# EAGLE design thermistor (EAGLE 9.4.2)
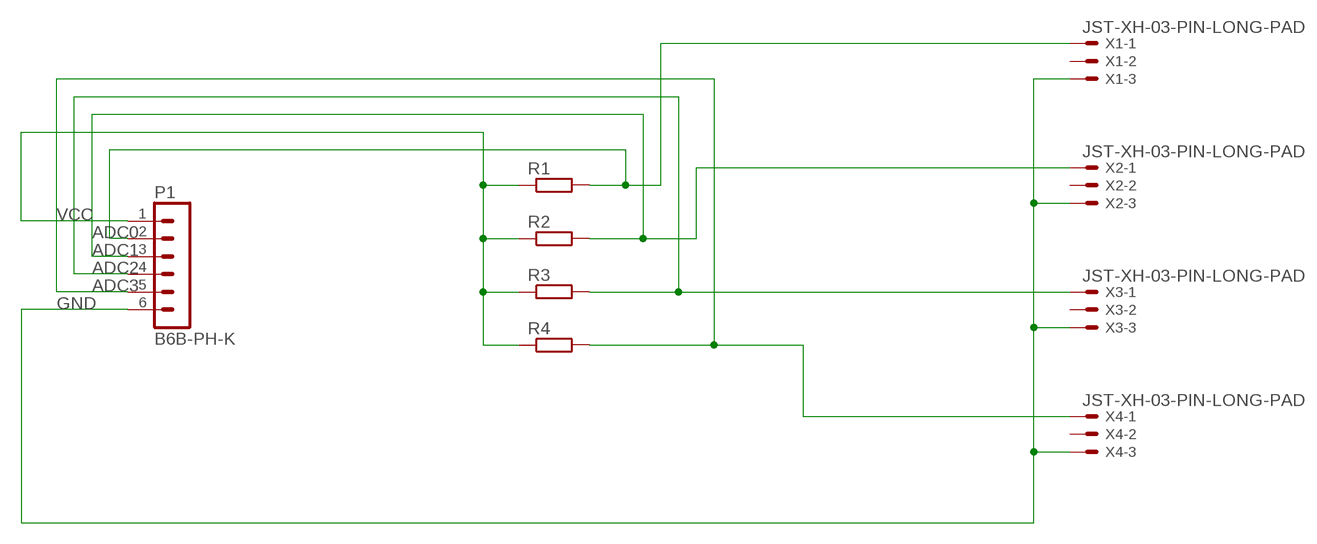
[diagram p0: schematic, sheet 1]

## Parts
P1  B6B-PH-K  [B6B-PH-K]
R1  R-EU_0207/10  [0207/10]
R2  R-EU_0207/10  [0207/10]
R3  R-EU_0207/10  [0207/10]
R4  R-EU_0207/10  [0207/10]
X1  JST-XH-03-PIN-LONG-PAD  [JST-XH-03-PACKAGE-LONG-PAD]
X2  JST-XH-03-PIN-LONG-PAD  [JST-XH-03-PACKAGE-LONG-PAD]
X3  JST-XH-03-PIN-LONG-PAD  [JST-XH-03-PACKAGE-LONG-PAD]
X4  JST-XH-03-PIN-LONG-PAD  [JST-XH-03-PACKAGE-LONG-PAD]

## Nets
ADC0: P1.2 R1.2 X1.1
ADC1: P1.3 R2.2 X2.1
ADC2: P1.4 R3.2 X3.1
ADC3: P1.5 R4.2 X4.1
GND: P1.6 X1.3 X2.3 X3.3 X4.3
VCC: P1.1 R1.1 R2.1 R3.1 R4.1
Unconnected: X1.2 X2.2 X3.2 X4.2

## Library data of the parts
P1 = con-jst-ph:B6B-PH-K: HEADER
R1-R4 = rcl:R-EU_: RESISTOR, European symbol; SPICEPREFIX: R
X1-X4 = Rembrandt Electronics - JST XH Connectors v1-0:JST-XH-03-PIN: JST XH Connector 2 Pin Wire to board connector. Pitch: 2,54 mm, (0.100") Number of pins: 3 Created by Rembrandt Electronics www.rembrandtelectronics.com

## Board
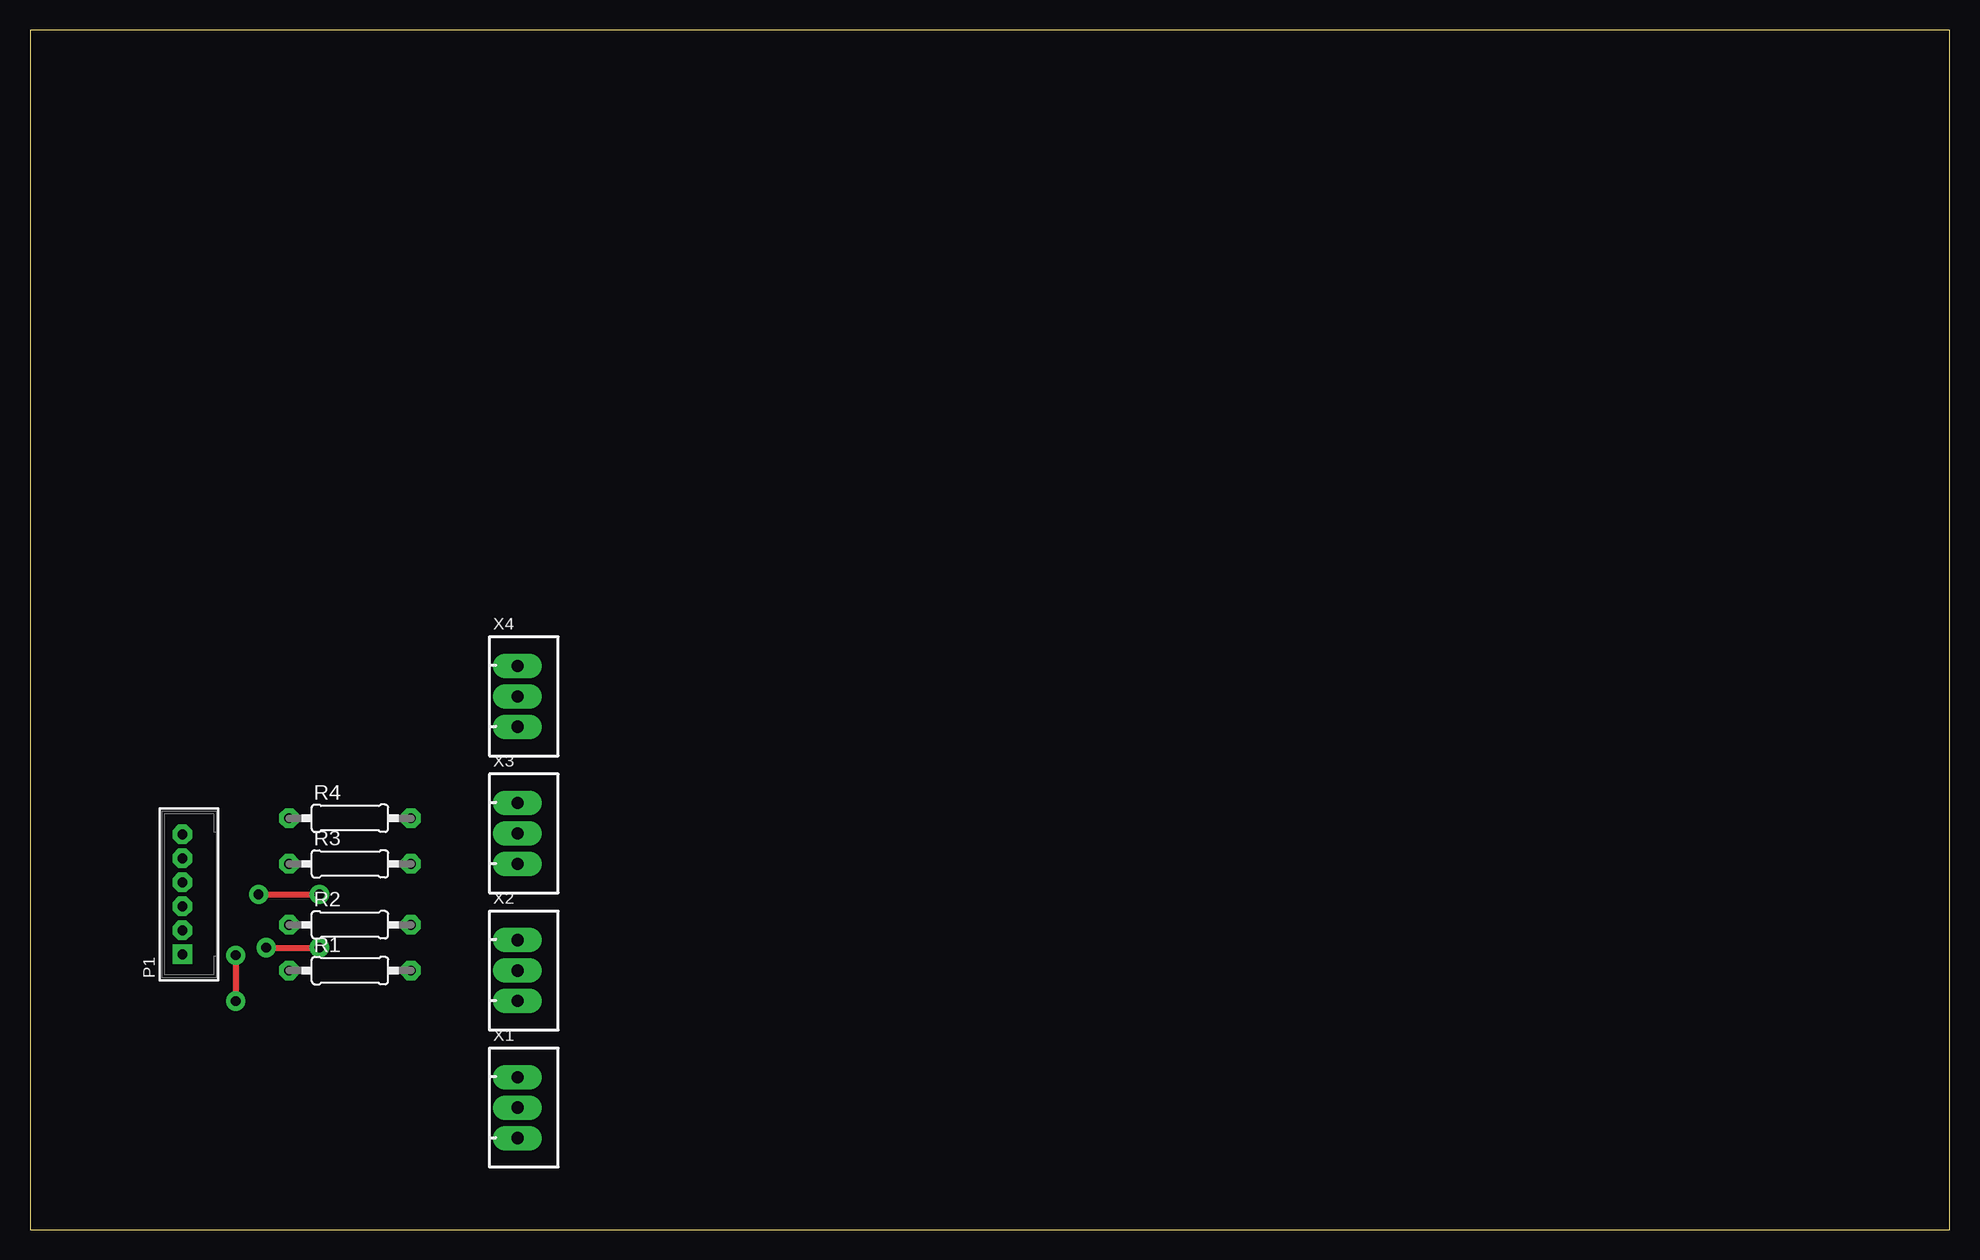
[diagram p1: board, top side]
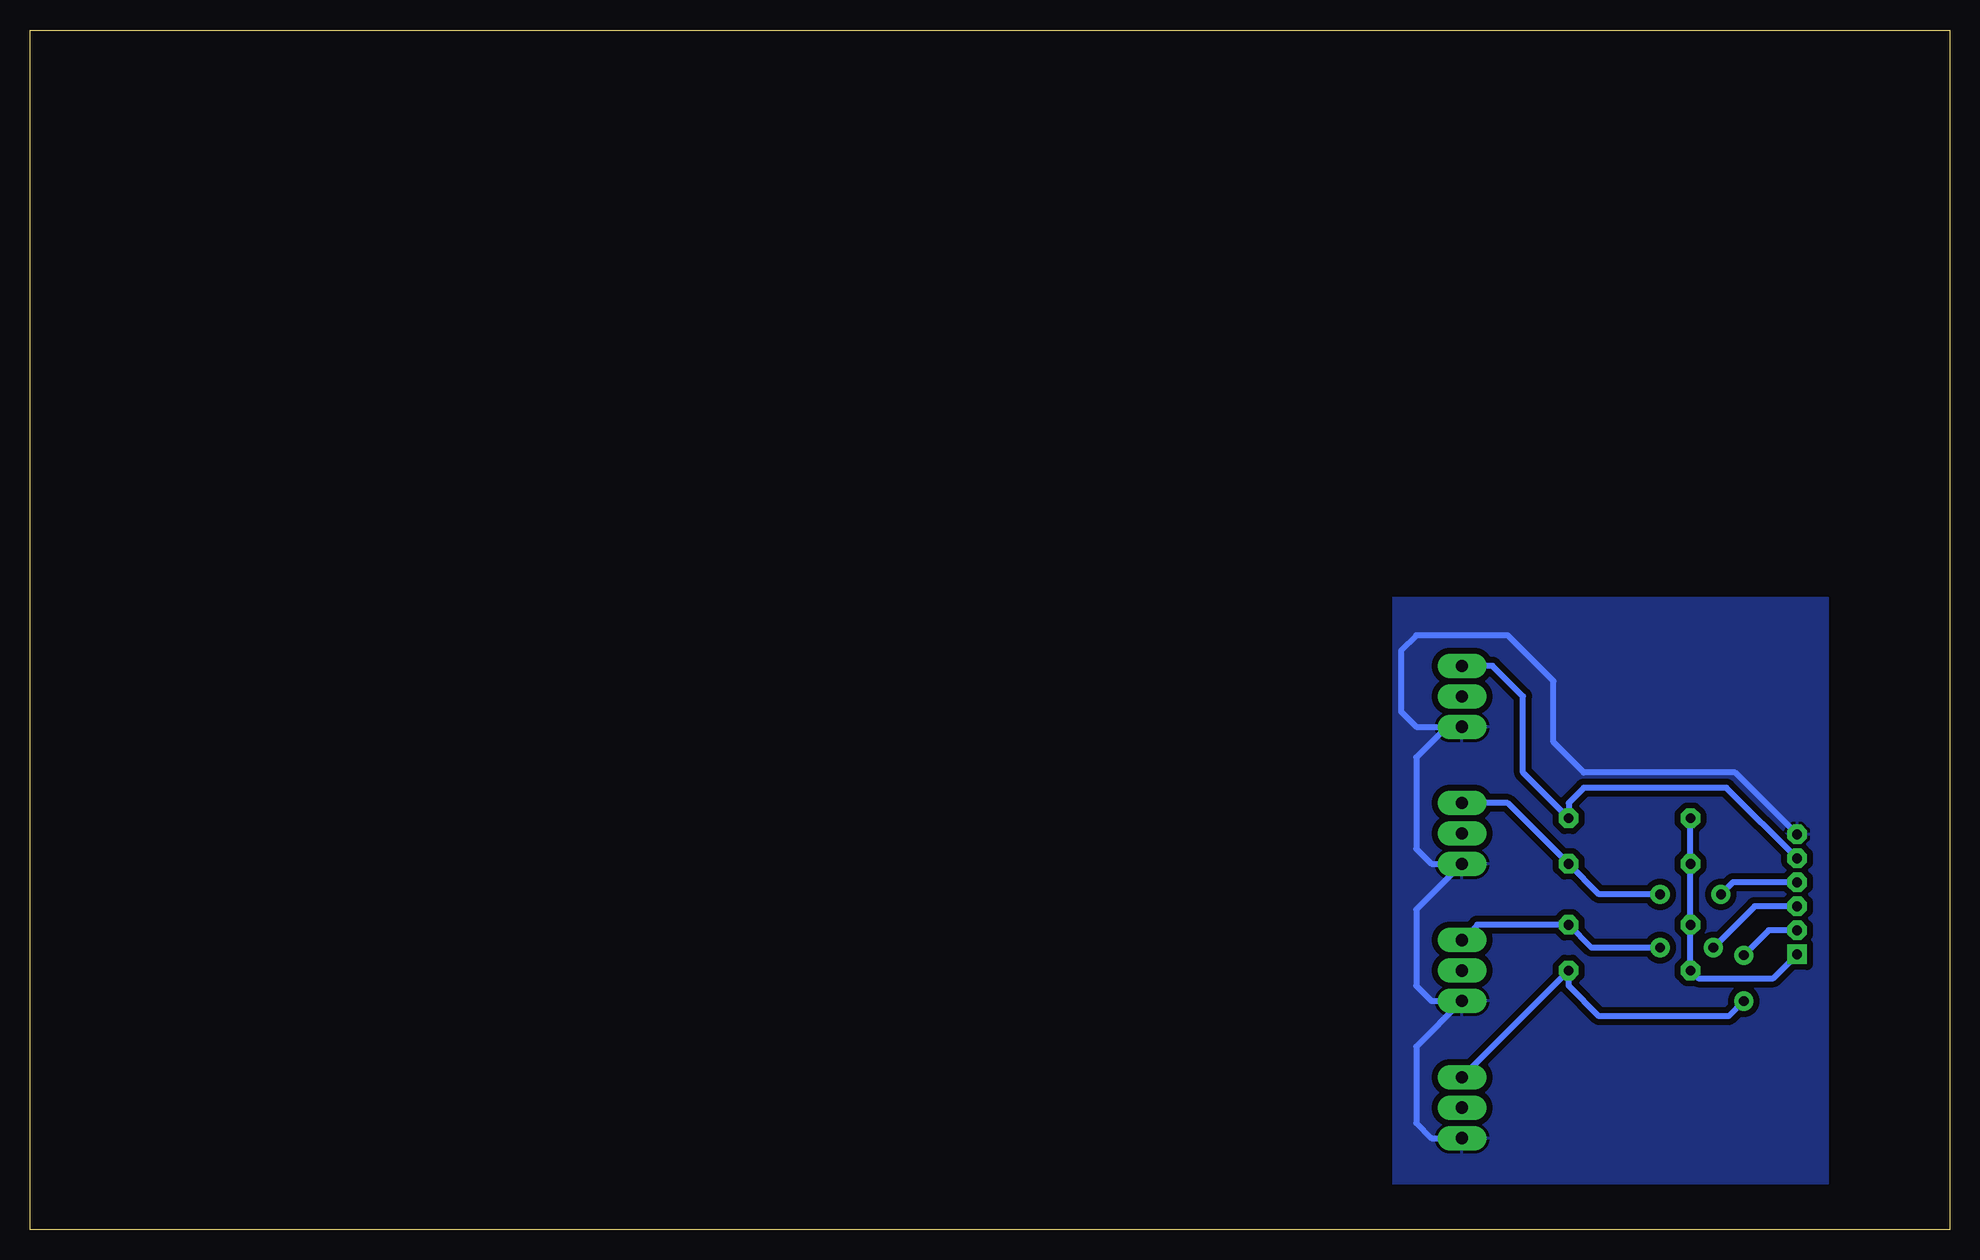
[diagram p2: board, bottom side, seen from below]

Size 160 x 100 mm. Coordinates in mm from the lower left corner, seen from the top.
Outline: 0,0 160,0 160,100 0,100 0,0
Copper layers (1*16): Top 0.035mm / dielectric 1.5mm / Bottom 0.035mm
Design rules "default *": minimum track width 6mil, minimum drill 0.65mm, track to track 6mil, track to pad 6mil, pad to pad 6mil, via to via 6mil, smd to smd 6mil, copper to edge 40mil, drill to drill 6mil, minimum pad ring 10mil, minimum via ring 8mil, stop-mask expansion 4mil, vias tented up to drill 0mil, thermal gap 10mil

### Footprints (pad centres in the part's own frame; a part is rotated, then mirrored left to right if it is on the bottom)
B6B-PH-K = drill 0.813 square: 1 -5,0 | drill 0.813 octagon: 2 -3,0; 3 -1,0; 4 1,0; 5 3,0; 6 5,0
0207/10 = drill 0.813 octagon: 1 -5.08,0; 2 5.08,0
JST-XH-03-PACKAGE-LONG-PAD = drill 1.016 long: 1 -2.54,0; 2 0,0; 3 2.54,0

### Placement (x,y rotation side)
P1  12.7,27.94 90 top
R1  26.67,21.59 0 top
R2  26.67,25.4 0 top
R3  26.67,30.48 0 top
R4  26.67,34.29 0 top
X1  40.64,10.16 270 top
X2  40.64,21.59 270 top
X3  40.64,33.02 270 top
X4  40.64,44.45 270 top

### Tracks (layer width: path | path; a pad name or v marks a point on that pad's centre or on a via)
ADC0  (via drill 0.8)
  Top 0.5: v17.14,22.86 v17.14,19.05
  Bottom 0.5: X1.1 R1.2 31.75,20.32 29.21,17.78 18.41,17.78 v17.14,19.05 | P1.2 15.06,24.94 v17.14,22.86
ADC1  (via drill 0.8)
  Top 0.5: v19.68,23.5 v24.13,23.5
  Bottom 0.5: X2.1 39.37,25.4 R2.2 29.84,23.5 v24.13,23.5 | P1.3 16.24,26.94 v19.68,23.5
ADC2  (via drill 0.8)
  Top 0.5: v19.05,27.94 v24.13,27.94
  Bottom 0.5: X3.1 36.83,35.56 R3.2 29.21,27.94 v24.13,27.94 | P1.4 18.05,28.94 v19.05,27.94
ADC3
  Bottom 0.5: X4.1 38.1,46.99 35.56,44.45 35.56,38.1 R4.2 31.75,35.56 30.48,36.83 18.59,36.83 P1.5
GND
  Bottom 0.5: X4.3 41.91,41.91 | 41.91,41.91 44.45,39.37 44.45,31.75 43.18,30.48 X3.3 44.45,26.67 44.45,20.32 43.18,19.05 X2.3 44.45,15.24 44.45,8.89 43.18,7.62 X1.3 | P1.6 17.86,38.1 30.48,38.1 33.02,40.64 33.02,45.72 36.83,49.53 44.45,49.53 45.72,48.26 45.72,43.18 44.45,41.91 41.91,41.91
  pour Bottom (isolate 0.5): 10.16,52.7 10.16,3.81 46.35,3.81 46.35,52.7
VCC
  Bottom 0.5: P1.1 14.69,20.95 20.95,20.95 R1.1 R2.1 R3.1 R4.1